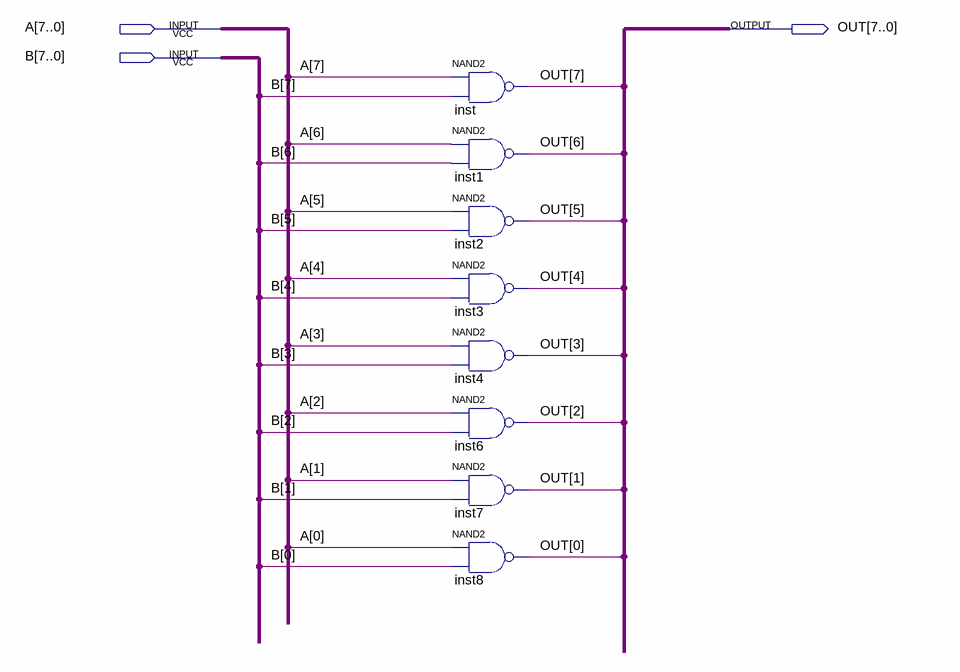
[diagram p0: schematic sheet]
// Quartus schematic NAND8BIT.bdf as structural Verilog: 8 symbols, 3 pins
module NAND8BIT (
  input  [7:0] A,
  input  [7:0] B,
  output [7:0] OUT
);

  nand inst (OUT[7], A[7], B[7]);
  nand inst1 (OUT[6], A[6], B[6]);
  nand inst2 (OUT[5], A[5], B[5]);
  nand inst3 (OUT[4], A[4], B[4]);
  nand inst4 (OUT[3], A[3], B[3]);
  nand inst6 (OUT[2], A[2], B[2]);
  nand inst7 (OUT[1], A[1], B[1]);
  nand inst8 (OUT[0], A[0], B[0]);
endmodule
